# Altium project SensorSquare.PrjPcb
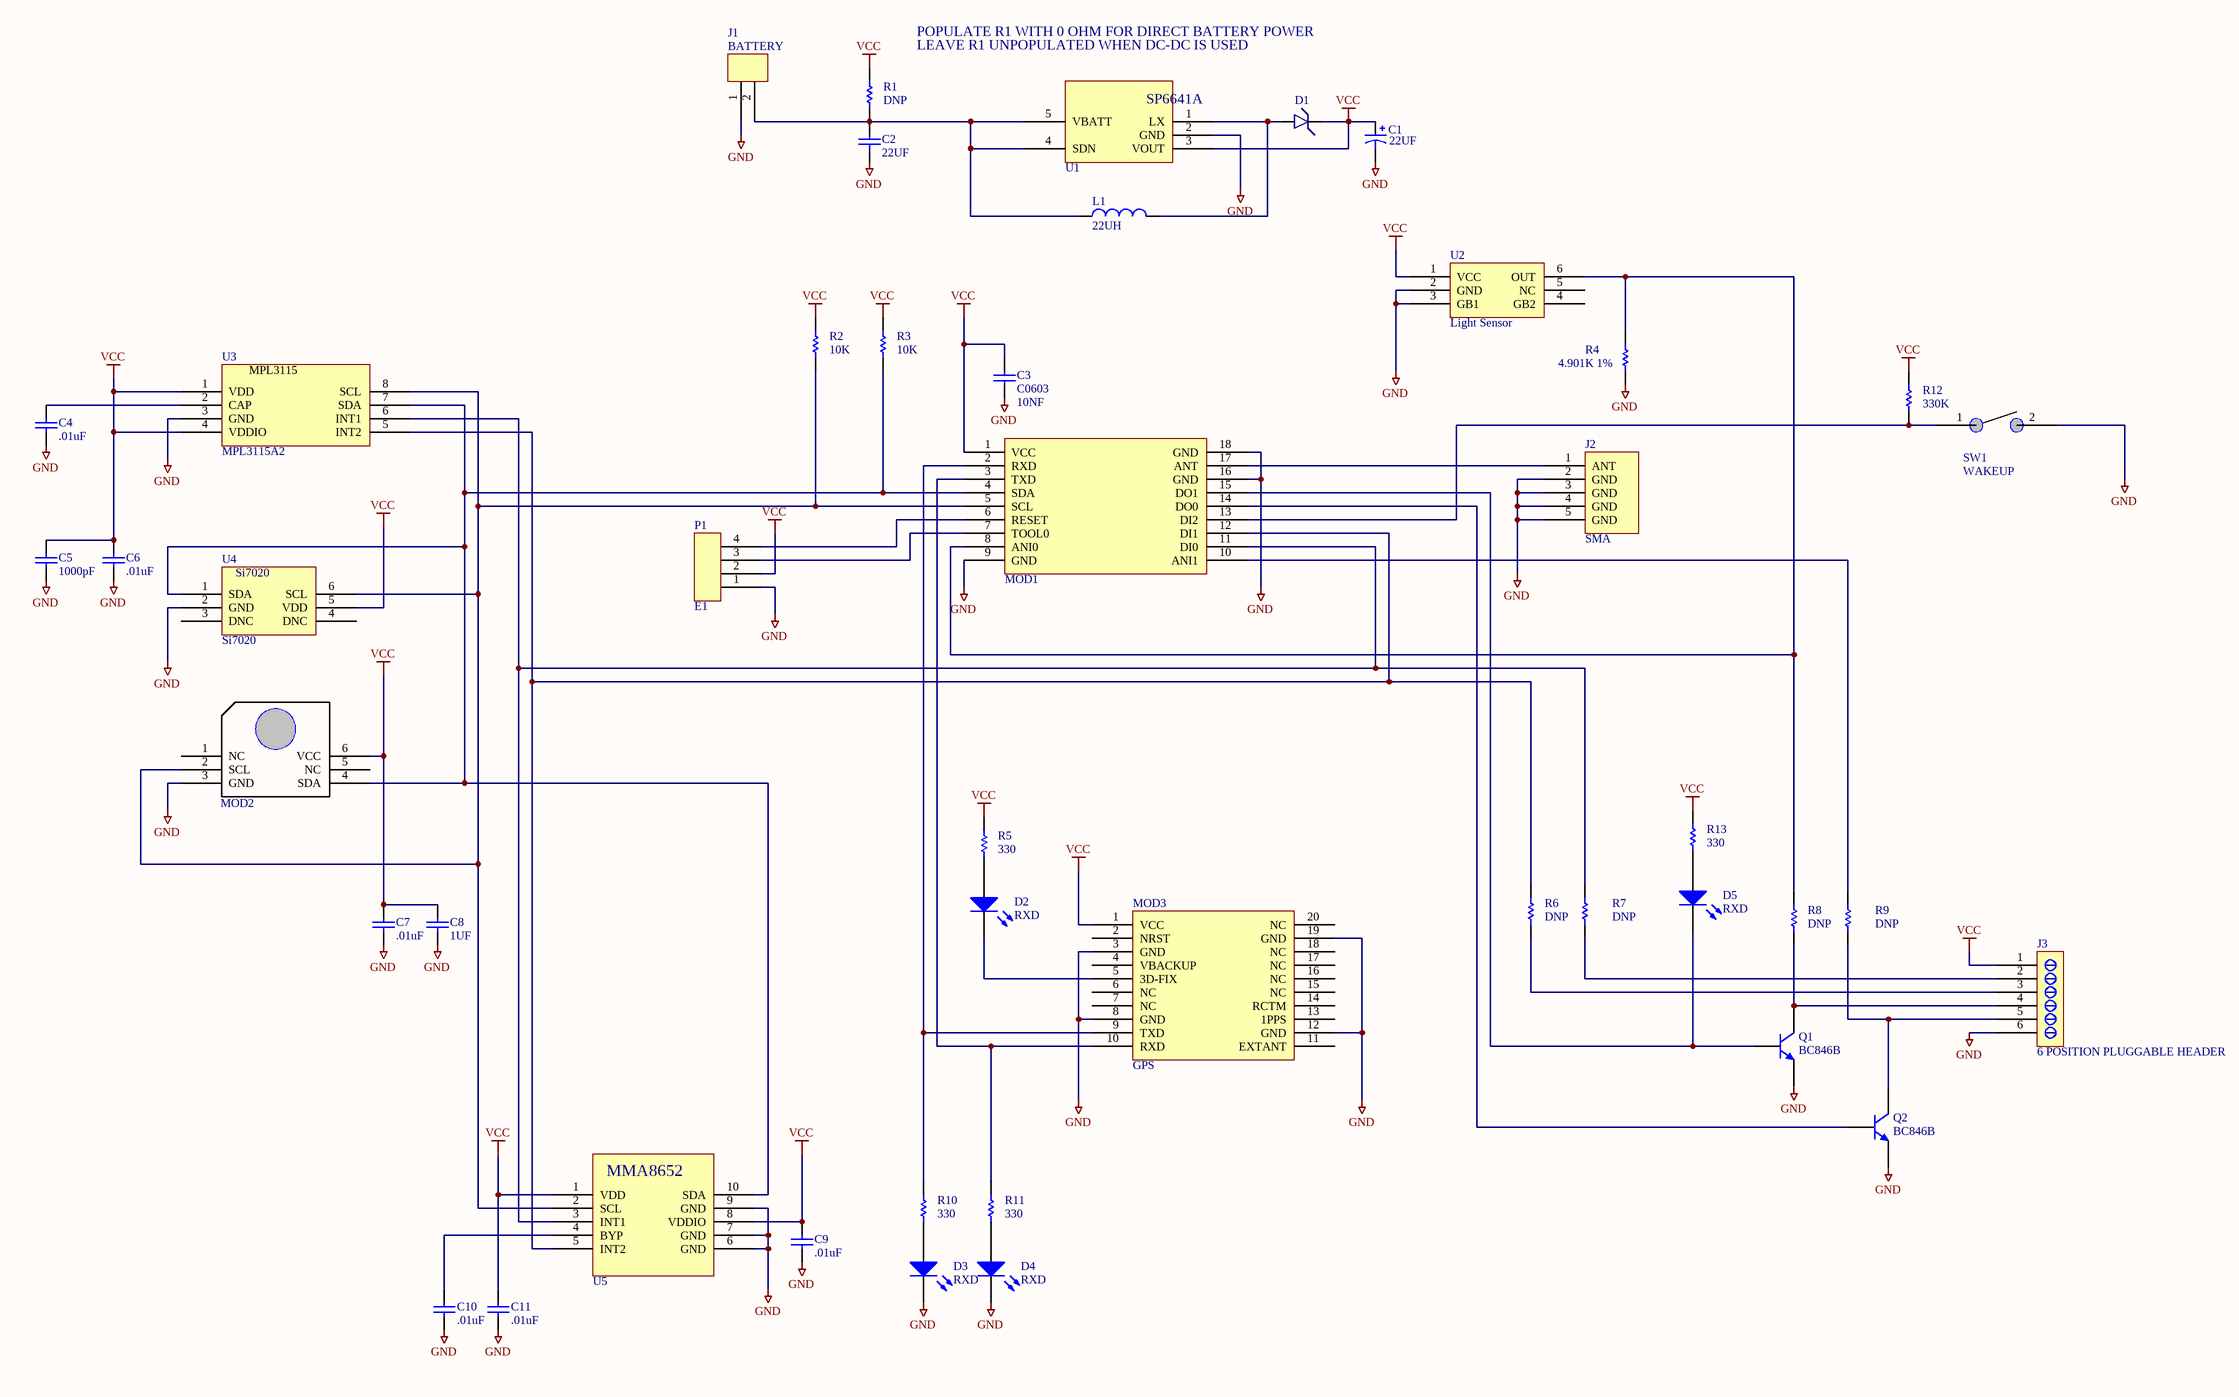
[diagram p0: SensorSquare.SchDoc]
1 sheet, 45 parts. Net scope: global (net labels, ports and power ports of the same name join across sheets).
Board files: SensorSquare.PcbDoc, wio_logo.PcbDoc

## Sheet SensorSquare.SchDoc: Whisker.IO SensorSquare
size C; DrawnBy: SJM; Engineer: SJM; Organization: D6 Labs; Address1: 414 Ash Ave; Address2: Yukon OK 73099; Address3: 1 (888) 551-0112; Address4: www.d6labs.com; Revision: 0.A; SheetNumber: 1; SheetTotal: 1; PageSetup: Record=PageOptions|CenterHorizontal=True|CenterVertical=True|PrintScale=0.53|XCorrection=1.00|YCorrection=1.00|PrintKind=2|BorderSize=5000000|LeftOffset=0|BottomOffset=0|Orientation=2|PaperLength=1000|PaperWidth=1000|Scale=100|PaperSource=7|PrintQuality=-4|MediaType=1|DitherType=10|PaperKind=Letter|PrintScaleMode=1; ProjectName: IoT Enabler

### Parts
C1  value 22UF  [1812]  (hidden comment: Cap Pol3)
C2  22UF  [1210]
C3  C0603  value 10NF  [0603]
C4  .01uF  [D6_0603_RES]
C5  1000pF  [D6_0603_RES]
C6  .01uF  [D6_0603_RES]
C7  .01uF  [D6_0603_RES]
C8  1UF  [D6_0603_RES]
C9  .01uF  [D6_0603_RES]
C10  .01uF  [D6_0603_RES]
C11  .01uF  [D6_0603_RES]
D1  SCHOTKY DIODE  [SOD123]  (value not drawn)
D2  RXD  [3.2X1.6X1.1]
D3  RXD  [3.2X1.6X1.1]
D4  RXD  [3.2X1.6X1.1]
D5  RXD  [3.2X1.6X1.1]
J1  BATTERY  [S2B-PH-SM4]
J2  SMA  [RPSMA-EDGEMOUNT]
J3  6 POSITION PLUGGABLE HEADER  [6POS 5.08MM PLUGGABLE]
L1  22UH  [INDC4532]
MOD1  WhiskerModule  [WHISKER_SMD_DOLLY]  (value not drawn)
MOD2  IAQ_ENGINE  [IAQENGINE]  (value not drawn)
MOD3  GPS  [GPS-SOP20]
P1  E1  [2MM4PINHDR]
Q1  BC846B  [SOT23]
Q2  BC846B  [SOT23]
R1  DNP  [ERA-0603]
R2  10K  [3-0603]
R3  10K  [3-0603]
R4  4.901K 1%  [D6_0603_RES]
R5  330  [ERA-0603]
R6  DNP  [ERA-0603]
R7  DNP  [ERA-0603]
R8  DNP  [ERA-0603]
R9  DNP  [ERA-0603]
R10  330  [ERA-0603]
R11  330  [ERA-0603]
R12  330K  [D6_0603_RES]
R13  330  [ERA-0603]
SW1  WAKEUP  [MK23-35-B-2]
U1  500MA ALKALINE DC\DC BOOST REGULATOR SOT-23  [SOT95P280X110-5N]  (value not drawn)
U2  Light Sensor  [CUDFN6]
U3  MPL3115A2  [LGA8]
U4  Si7020  [DFN6]
U5  MMA8652  [DFN10]  (value not drawn)

### Nets
GND: C1.2 C2.1 C3.1 C4.1 C5.1 C6.1 C7.1 C8.1 C9.1 C10.1 C11.1 D3.2(K) D4.2(K) J1.1 J2.2(GND) J2.3(GND) J2.4(GND) J2.5(GND) J3.6(RESERVED) MOD1.9(GND) MOD1.16(GND) MOD1.18(GND) MOD2.3(GND) MOD3.3(GND) MOD3.8(GND) MOD3.12(GND) MOD3.19(GND) P1.1(RESET) Q1.2(E) Q2.2(E) R4.2 SW1.2 U1.2(GND) U2.2(GND) U2.3(GB1) U3.3(GND) U4.2(GND) U5.6(GND) U5.7(GND) U5.9(GND)
VCC: C1.1 C3.2 C5.2 C6.2 C7.2 C8.2 C9.2 C11.2 D1.K(VBATT) J3.1(RESERVED) MOD1.1(VCC) MOD2.6(VCC) MOD3.1(VCC) P1.2(RESET) R1.1 R2.2 R3.2 R5.1 R12.1 R13.1 U1.3(VOUT) U2.1(VCC) U3.1(VDD) U3.4(VDDIO) U4.5(VDD) U5.1(VDD) U5.8(VDDIO)
NetC2_2: C2.2 J1.2 L1.1 R1.2 U1.4(SDN) U1.5(VBATT)
NetC4_2: C4.2 U3.2(CAP)
NetC10_2: C10.2 U5.4(BYP)
NetD1_A: D1.A(VBATT) L1.2 U1.1(LX)
NetD2_1: D2.1(A) R5.2
NetD2_2: D2.2(K) MOD3.5(3D-FIX)
NetD3_1: D3.1(A) R10.2
NetD4_1: D4.1(A) R11.2
NetD5_1: D5.1(A) R13.2
NetD5_2: D5.2(K) MOD1.15(DO1) Q1.3(B)
NetJ2_1: J2.1(ANT) MOD1.17(ANT)
NetJ3_2: J3.2(RESERVED) R7.2
NetJ3_3: J3.3(RESERVED) R6.2
NetJ3_4: J3.4(RESERVED) Q1.1(C) R8.2
NetJ3_5: J3.5(RESERVED) Q2.1(C) R9.2
NetMOD1_2: MOD1.2(RXD) MOD3.9(TXD) R10.1
NetMOD1_3: MOD1.3(TXD) MOD3.10(RXD) R11.1
NetMOD1_4: MOD1.4(SDA) MOD2.4(SDA) R3.1 U3.7(SDA) U4.1(SDA) U5.10(SDA)
NetMOD1_5: MOD1.5(SCL) MOD2.2(SCL) R2.1 U3.8(SCL) U4.6(SCL) U5.2(SCL)
NetMOD1_6: MOD1.6(RESET) P1.4(RESET)
NetMOD1_7: MOD1.7(TOOL0) P1.3(RESET)
NetMOD1_8: MOD1.8(ANI0) R4.1 R8.1 U2.6(OUT)
NetMOD1_10: MOD1.10(ANI1) R9.1
NetMOD1_11: MOD1.11(DI0) R7.1 U3.6(INT1) U5.3(INT1)
NetMOD1_12: MOD1.12(DI1) R6.1 U3.5(INT2) U5.5(INT2)
NetMOD1_13: MOD1.13(DI2) R12.2 SW1.1
NetMOD1_14: MOD1.14(DO0) Q2.3(B)

Not connected (* = marked no-connect by the designer): MOD2 1(NC) 5(NC); MOD3 2(NRST) 4(VBACKUP) 6(NC) 7(NC) 11(EXTANT) 13(1PPS) 14(RCTM) 15(NC) 16(NC) 17(NC) 18(NC) 20(NC); U2 4(GB2) 5(NC); U4 3(DNC) 4(DNC)

### Notes on the sheet
- POPULATE R1 WITH 0 OHM FOR DIRECT BATTERY POWER
- LEAVE R1 UNPOPULATED WHEN DC-DC IS USED
- (in symbol MPL3115A2) MPL3115

### Library data of the parts
C1 = Cap Pol3: Polarized Capacitor (Surface Mount); VENDOR PART NUMBER: 647-F930J336MBA; MANUFACTURER: AVX; MANUFACTURER PART NUMBER: 647-647-F930J336MBA; VENDOR: MOUSER; COST EACH: .19
C2 = C1210: Ceramic Chip Capacitor - Standard; MANUFACTURER: AVX; MANUFACTURER PART NUMBER: TPSB107K006R0400; VENDOR PART NUMBER: 581-TPSB107K006R0400; VENDOR: MOUSER; COST EACH: .198
C3 = C0603: Ceramic Chip Capacitor - Standard; VENDOR PART NUMBER: 140-CC504B103K-RC; MANUFACTURER: XICON; VENDOR: MOUSER; COST EACH: .008; MANUFACTURER PART NUMBER: 140-CC504B103K-RC
C4-C11 = C1210: Ceramic Chip Capacitor - Standard; MANUFACTURER: VISHAY; MANUFACTURER PART NUMBER: VJ0603A150JXACW1BC; VENDOR PART NUMBER: 77-VJ0603A150JXACW1BC; VENDOR: MOUSER; COST EACH: .02
D1 = SCHOTKY DIODE: SCHOTKY DIODE SOD-123; MANUFACTURER: ST; MANUFACTURER PART NUMBER: STPS0520Z; VENDOR PART NUMBER: 511-STPS0520Z; VENDOR: DIGIKEY; COST EACH: .123
D2-D5 = LED2: Typical RED, GREEN, YELLOW, AMBER GaAs LED; Published: 8-Jun-2000; LatestRevisionDate: 17-Jul-2002; LatestRevisionNote: Re-released for DXP Platform.; PackageVersion: Feb-2002; PackageReference: 3.2X1.6X1.1; Publisher: Altium Limited; PackageDescription: SM LED; 2 Flat Leads
J1 = S2B-PH-SM4-TB: 2 POSITION, 2MM RIGHT ANGLE CONNECTOR; MANUFACTURER: JST; VENDOR PART NUMBER: 455-1749-6-ND; VENDOR: DIGIKEY; COST EACH: .35; MANUFACTURER PART NUMBER: S2B-PH-SM4-TB
J3 = 6 POSITION PLUGGABLE HEADER: MANUFACTURER: FCI CONN; MANUFACTURER PART NUMBER: 20020110-H061A01LF; VENDOR PART NUMBER: 649-20020110-H061A01LF; VENDOR: MOUSER; COST EACH: .68
L1 = Inductor: MANUFACTURER: TDK; MANUFACTURER PART NUMBER: NLC453232T-220K-PF; VENDOR PART NUMBER: 810-NLC453232T220KPF; VENDOR: MOUSER; COST EACH: .218
MOD1 = WhiskerModule: Whisker Footprint
MOD2 = IAQ_ENGINE: Indoor Air Quality Sensor Module
MOD3 = ULTIMATEGPS: MANUFACTURER: GTOP; MANUFACTURER PART NUMBER: FGPMMOPA6H; VENDOR PART NUMBER: PID790; VENDOR: ADA FRUIT; COST EACH: 29.95
P1 = 2MM4PINHDR
Q1 Q2 = BC846B: SOT23 NPN Silicon Planar General Purpose Transistor; MANUFACTURER: ON SEMI; MANUFACTURER PART NUMBER: MMUN2232LT1G; VENDOR PART NUMBER: 863-MMUN2232LT1G; VENDOR: MOUSER; COST EACH: .14; Published: 8-Jun-2000; LatestRevisionDate: 17-Jul-2002; LatestRevisionNote: Re-released for DXP Platform.; DatasheetVersion: Jan-1997; PackageVersion: 1996; PackageReference: SOT23; Publisher: Altium Limited; PackageDescription: SOT-23; 3 Leads; Body 3.1 x 2.5 mm, inc. leads (LxW max), Alternate Lead Configuration; ComponentLink1Description: Manufacturer Link; ComponentLink1URL: http://www.zetex.com/
R1 R5-R11 R13 = ERA3Y: Rectangular Thick Film Chip Resistor, 10 Ohm to 330k Ohm Range, 0.1% and 0.5% Tolerance, 0603 Size, 0.063 W; VENDOR PART NUMBER: 301-330-RC; MANUFACTURER: XICON; VENDOR: MOUSER; COST EACH: .003; MANUFACTURER PART NUMBER: 301-330-RC
R2 R3 = ERJ3BQ: Low Ohmic Value Thick Film Chip Resistor, 0.22 Ohm to 9.1 Ohm Range, 1%, 2% and 5% Tolerance, 0603 Size, 0.2 W; Published: 17-Dec-2003; LatestRevisionDate: 19-Mar-2004; LatestRevisionNote: Silkscreen size reduced.; PackageDocument: Mar-2003; PackageReference: 3-0603; Publisher: Altium Limited; Code_IPC: 1608 [0603]; ComponentLink1Description: Manufacturer Link; ComponentLink1URL: http://www.panasonic.com/industrial/components/resistive_products.htm; ComponentLink2Description: Datasheet; ComponentLink2URL: http://www.panasonic.com/industrial/components/pdf/AOA0000CE3.pdf
R4 R12 = ERA3Y: Rectangular Thick Film Chip Resistor, 10 Ohm to 330k Ohm Range, 0.1% and 0.5% Tolerance, 0603 Size, 0.063 W; VENDOR PART NUMBER: 301-100K-RC; MANUFACTURER: XICON; VENDOR: MOUSER; COST EACH: .002; MANUFACTURER PART NUMBER: 301-100K-RC
SW1 = MK23-35-B-2: SMT Reed Switch; MANUFACTURER: MEDER; VENDOR PART NUMBER: 876-MK23-35-B-2; VENDOR: MOUSER; COST EACH: 1.11; MANUFACTURER PART NUMBER: MK23-35-B-2
U1 = 500MA ALKALINE DC\DC BOOST REGULATOR SOT-23: SP6641A; MANUFACTURER: SIPEX; MANUFACTURER PART NUMBER: SP6641BEK-L-3-3; VENDOR PART NUMBER: 701-SP6641BEK-L-3-3; VENDOR: MOUSER; COST EACH: 1.01
U2 = NOA1212: Ambient Light Sensor with Dark Comp; MANUFACTURER: ON SEMI; MANUFACTURER PART NUMBER: NOA1212CUTAG; VENDOR PART NUMBER: 863-NOA1212CUTAG; VENDOR: MOUSER; COST EACH: .278
U3 = MPL3115A2: Precision altimeter; MANUFACTURER: FREESCALE; VENDOR PART NUMBER: 841-MPL3115A2R1; VENDOR: MOUSER; COST EACH: 1.6; MANUFACTURER PART NUMBER: MPL3115A2
U4 = Si7020: I2C Temperature and Humidity Sensor; VENDOR PART NUMBER: 634- Si7020-A10-GM; MANUFACTURER: SILICON LABORATORIES; MANUFACTURER PART NUMBER: Si7020-A10-GM; VENDOR: MOUSER; COST EACH: 3.24
U5 = MMA8652: 3-axis, 12-bit accelerometer; MANUFACTURER: FREESCALE; MANUFACTURER PART NUMBER: 863-NOA1212CUTAG; VENDOR PART NUMBER: 841-MMA8652FCR1; VENDOR: MOUSER; COST EACH: .945